# Altium schematic sheet TOP.SchDoc: HB+SPO2 | Top
size A4; DocumentNumber: 1; Revision: 1b; SheetNumber: 1; SheetTotal: 4
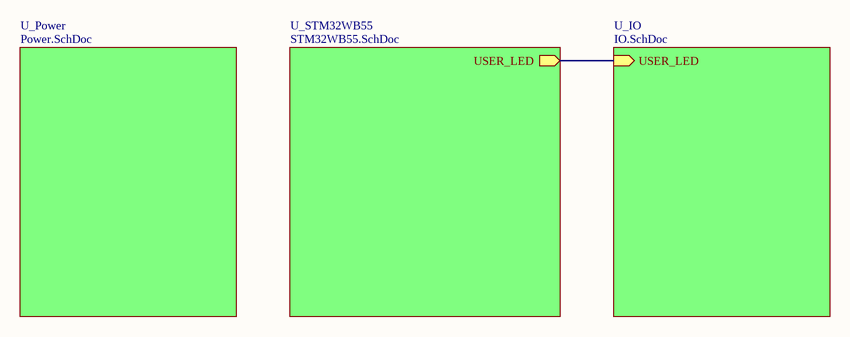
[diagram p0: TOP.SchDoc]

## Sub-sheets
U_IO = IO.SchDoc: USER_LED (in)
U_Power = Power.SchDoc: no entries
U_STM32WB55 = STM32WB55.SchDoc: USER_LED (out)

## Nets
(unnamed): sheet U_IO/USER_LED, sheet U_STM32WB55/USER_LED

## Notes on the sheet
- Title
- Size:
- Date:
- A4
- Number:
- Time:
- Revision:
- Sheet
- of
- ShareFox
- File: